# Altium schematic sheet SN65LVDS.SchDoc
size A3
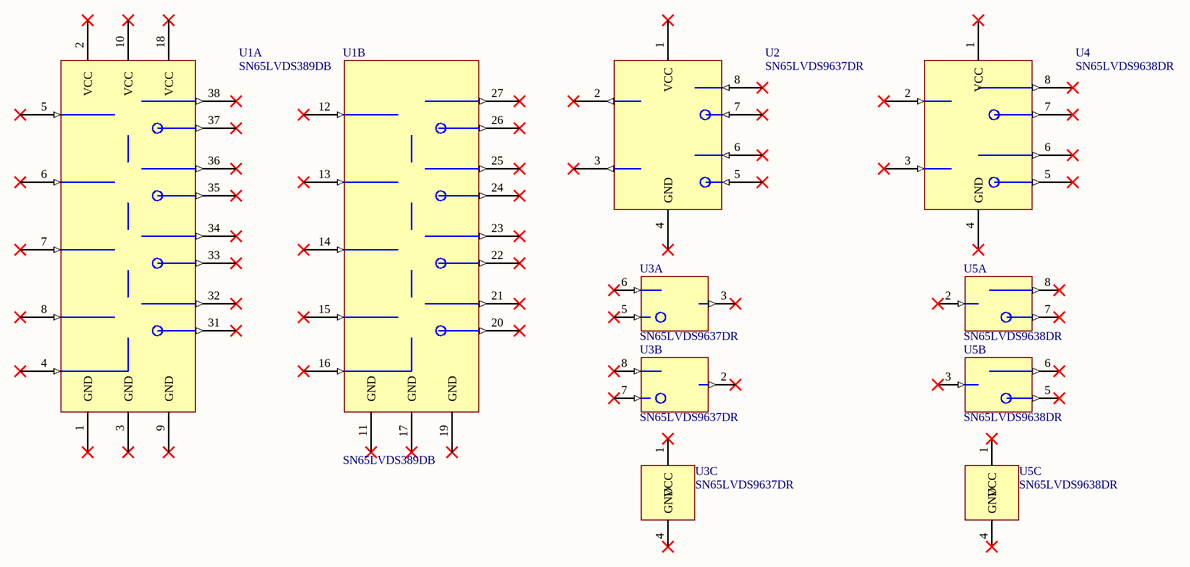
[diagram p0: SN65LVDS.SchDoc]

## Parts
U1  SN65LVDS389DB  [TSSOP38 - SN65LVDS389DB]  (parts A,B of 2)
U2  SN65LVDS9637DR  [SOIC8 - SN65LVDS9637]
U3  SN65LVDS9637DR  [SOIC8 - SN65LVDS9637]  (parts A,B,C of 3)
U4  SN65LVDS9638DR  [SOIC8 - SN65LVDS9638]
U5  SN65LVDS9638DR  [SOIC8 - SN65LVDS9638]  (parts A,B,C of 3)

## Nets

Not connected (* = marked no-connect by the designer): U1 1(GND)* 2(VCC)* 3(GND)* 4(ENA)* 5(A1A)* 6(A2A)* 7(A3A)* 8(A4A)* 9(GND)* 10(VCC)* 11(GND)* 12(B1A)* 13(B2A)* 14(B3A)* 15(B4A)* 16(ENB)* 17(GND)* 18(VCC)* 19(GND)* 20(B4Z)* 21(B4Y)* 22(B3Z)* 23(B3Y)* 24(B2Z)* 25(B2Y)* 26(B1Z)* 27(B1Y)* 28(NC_1) 29(NC_2) 30(NC_3) 31(A4Z)* 32(A4Y)* 33(A3Z)* 34(A3Y)* 35(A2Z)* 36(A2Y)* 37(A1Z)* 38(A1Y)*; U2 1(VCC)* 2(1Y)* 3(2Y)* 4(GND)* 5(2B)* 6(2A)* 7(1B)* 8(1A)*; U3 1(VCC)* 2(1Y)* 3(2Y)* 4(GND)* 5(2B)* 6(2A)* 7(1B)* 8(1A)*; U4 1(VCC)* 2(1Y)* 3(2Y)* 4(GND)* 5(2B)* 6(2A)* 7(1B)* 8(1A)*; U5 1(VCC)* 2(1Y)* 3(2Y)* 4(GND)* 5(2B)* 6(2A)* 7(1B)* 8(1A)*

## Library data of the parts
U1 = SN65LVDS389DB: SN65LVDS - Differential Drivers and Receivers
U2 = SN65LVDS9637DR Type-1: SN65LVDS - Differential Drivers and Receivers
U3 = SN65LVDS9637DR Type-2: SN65LVDS - Differential Drivers and Receivers
U4 = SN65LVDS9638DR Type-1: SN65LVDS - Differential Drivers and Receivers
U5 = SN65LVDS9638DR Type-2: SN65LVDS - Differential Drivers and Receivers